# Altium project digilent AD2 Adapter.PrjPcb
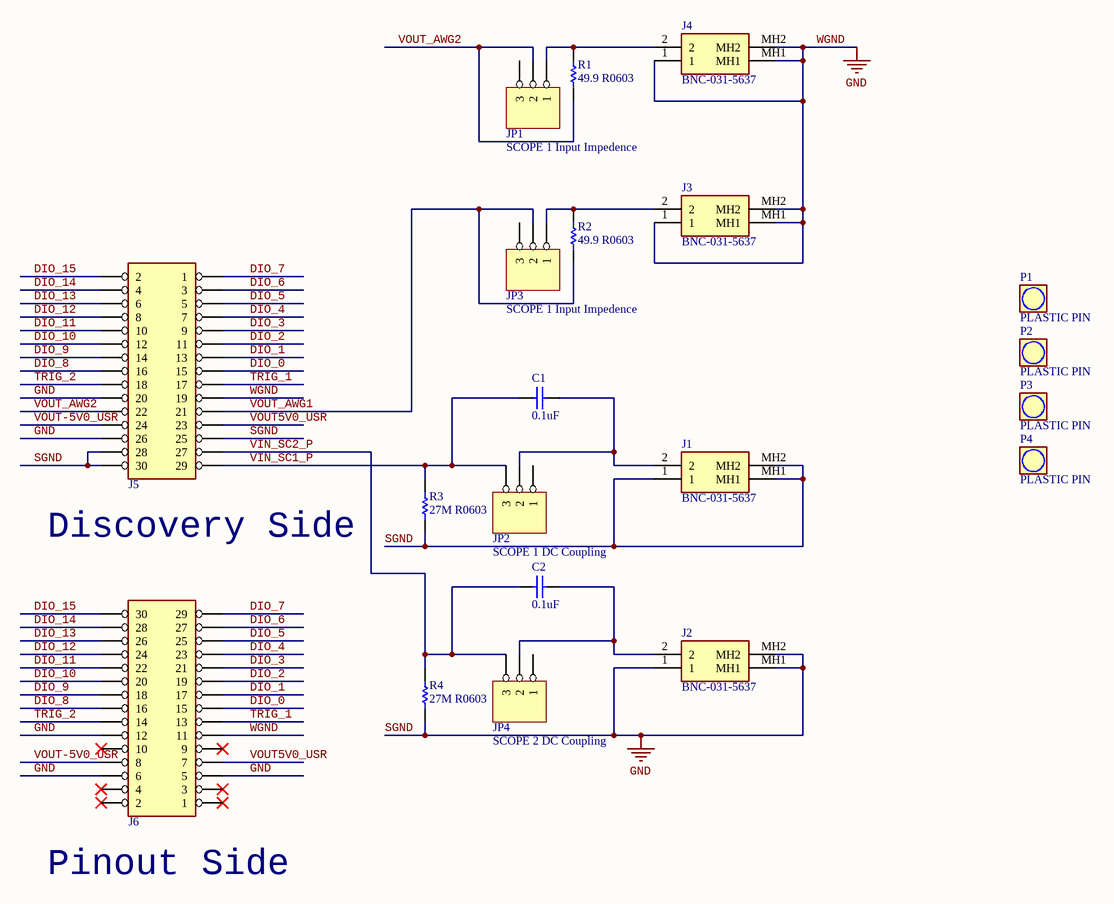
[diagram p0: adapter_rev1_tt.SchDoc]
1 sheet, 20 parts. Net scope: global (net labels, ports and power ports of the same name join across sheets).
Board file: ad2_adapter_tt_Rev1a.PcbDoc

## Sheet adapter_rev1_tt.SchDoc
size A3

### Parts
C1  0.1uF  [0603_C]
C2  0.1uF  [0603_C]
J1  BNC-031-5637  [0315637]
J2  BNC-031-5637  [0315637]
J3  BNC-031-5637  [0315637]
J4  BNC-031-5637  [0315637]
J5  HEADER 15x2  [HEADER15X2_CE]  (value not drawn)
J6  HEADER 15x2  [HEADER15X2_CE]  (value not drawn)
JP1  SCOPE 1 Input Impedence  [header3]
JP2  SCOPE 1 DC Coupling  [header3]
JP3  SCOPE 1 Input Impedence  [header3]
JP4  SCOPE 2 DC Coupling  [header3]
P1  PLASTIC PIN  [PLASTIC_PIN]
P2  PLASTIC PIN  [PLASTIC_PIN]
P3  PLASTIC PIN  [PLASTIC_PIN]
P4  PLASTIC PIN  [PLASTIC_PIN]
R1  49.9 R0603  [0603_R]
R2  49.9 R0603  [0603_R]
R3  27M R0603  [0603_R]
R4  27M R0603  [0603_R]

### Nets
GND: J1.1 J1.MH1 J1.MH2 J2.1 J2.MH1 J2.MH2 J3.1 J3.MH1 J3.MH2 J4.1 J4.MH1 J4.MH2 J5.19 J5.20 J5.25 J5.26 J5.28 J5.30 J6.5 J6.6 J6.11 J6.12 R3.1 R4.1  [also labelled SGND, WGND]
DIO_0: J5.15 J6.15
DIO_1: J5.13 J6.17
DIO_2: J5.11 J6.19
DIO_3: J5.9 J6.21
DIO_4: J5.7 J6.23
DIO_5: J5.5 J6.25
DIO_6: J5.3 J6.27
DIO_7: J5.1 J6.29
DIO_8: J5.16 J6.16
DIO_9: J5.14 J6.18
DIO_10: J5.12 J6.20
DIO_11: J5.10 J6.22
DIO_12: J5.8 J6.24
DIO_13: J5.6 J6.26
DIO_14: J5.4 J6.28
DIO_15: J5.2 J6.30
TRIG_1: J5.17 J6.13
TRIG_2: J5.18 J6.14
VIN_SC1_P: C1.1 J5.29 JP2.3 R3.2
VIN_SC2_P: C2.1 J5.27 JP4.3 R4.2
VOUT5V0_USR: J5.23 J6.7
VOUT-5V0_USR: J5.24 J6.8
VOUT_AWG1: J5.21 JP3.2 R2.2
VOUT_AWG2: J5.22 JP1.2 R1.2
NetC1_2: C1.2 J1.2 JP2.2
NetC2_2: C2.2 J2.2 JP4.2
NetJ3_2: J3.2 JP3.1 R2.1
NetJ4_2: J4.2 JP1.1 R1.1

Not connected (* = marked no-connect by the designer): J6 1* 2* 3* 4* 9* 10*; JP1 3; JP2 1; JP3 3; JP4 1

### Notes on the sheet
- (near J5) Discovery Side
- (near J6) Pinout Side

### Library data of the parts
C1 C2 = CAP: Capacitor; Value: 104; Published: 8-Jun-2000; LatestRevisionDate: 17-Jul-2002; LatestRevisionNote: Re-released for DXP Platform.; PackageReference: RAD-0.3; Publisher: Altium Limited
J1-J4 = BNC-031-5637: Connector; Manufacturer_Name: Amphenol; Datasheet Link: https://datasheet.datasheetarchive.com/originals/distributors/Datasheets-DGA15/760804.pdf; Manufacturer_Part_Number: 031-5637; Mouser Part Number: 523-31-5637; Mouser Price/Stock: https://www.mouser.co.uk/ProductDetail/Amphenol-RF/031-5637/?qs=%2FrA2Kvb8OYb4YSYQEIM5Nw%3D%3D; Arrow Part Number: 031-5637; Arrow Price/Stock: https://www.arrow.com/en/products/031-5637/amphenol-rf
JP1-JP4 = HEADER 3
P1-P4 = PLASTIC_PIN
R1-R4 = RES: Resistor; Value: 1K; Published: 8-Jun-2000; Revision: July-2002: Re-released for DXP Platform.; Publisher: Altium Limited